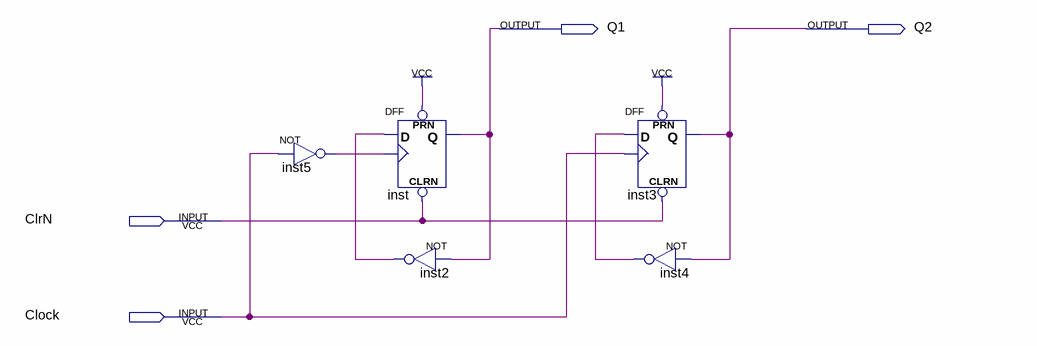
[diagram p0: schematic sheet]
// Quartus schematic Seq_Analysis1.bdf as structural Verilog: 5 symbols, 4 pins
module Seq_Analysis1 (
  input  ClrN,
  input  Clock,
  output Q1,
  output Q2
);

  wire inst2_out, inst4_out, inst5_out;

  not inst5 (inst5_out, Clock);
  DFF inst (.CLRN(ClrN), .CLK(inst5_out), .D(inst2_out), .PRN(1'b1), .Q(Q1));
  not inst2 (inst2_out, Q1);
  DFF inst3 (.CLRN(ClrN), .CLK(Clock), .D(inst4_out), .PRN(1'b1), .Q(Q2));
  not inst4 (inst4_out, Q2);
endmodule
